# Altium schematic sheet IO_PWR_FMU3_REV_G.SchDoc: Pixhawk_mini_8L.sch
size A4; Date: 18/08/2014 1:53:31 PM; DrawnBy: Philip Rowse; SheetNumber: 10; SheetTotal: 10
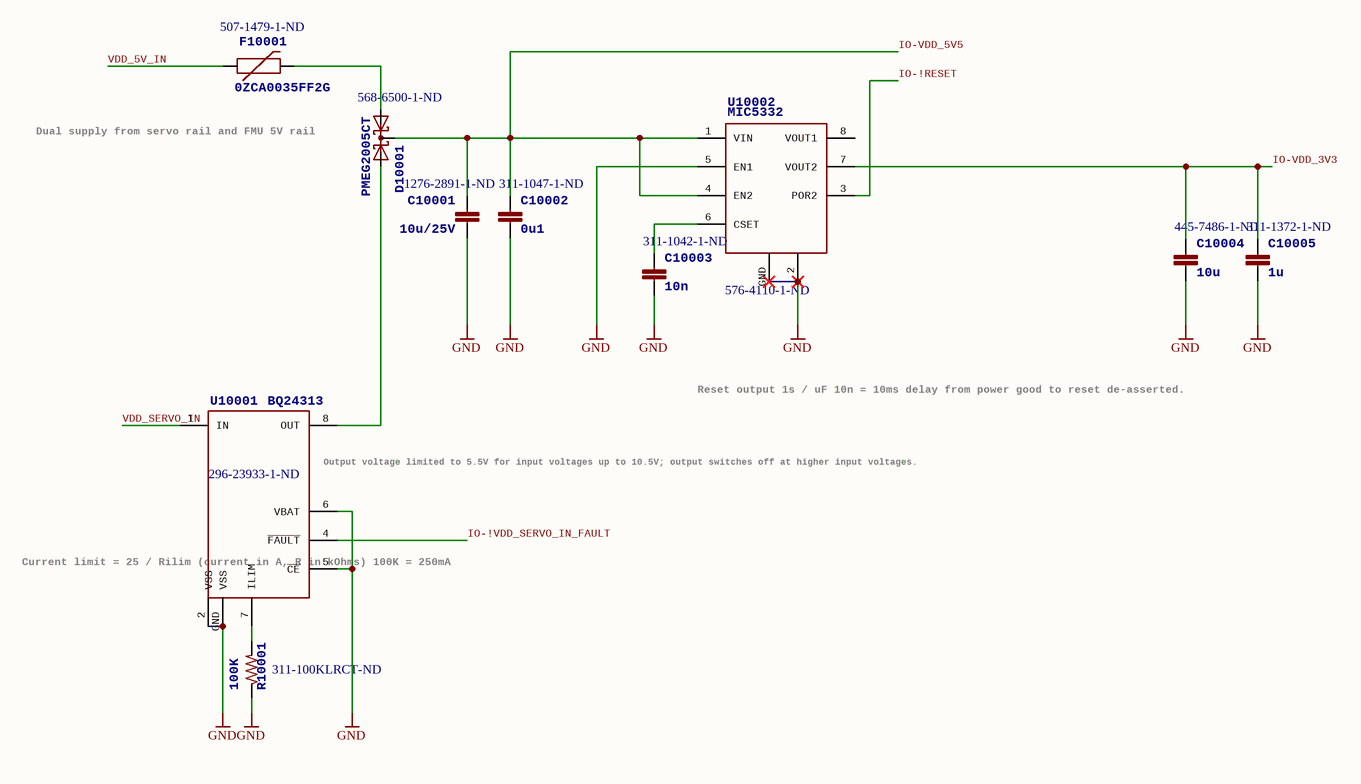
[diagram p0: IO_PWR_FMU3_REV_G.SchDoc]

## Parts
C10001  10u/25V  Supplier Part Number 1: 1276-2891-1-ND  [0805-CAP]
C10002  0u1  Supplier Part Number 1: 311-1047-1-ND  [0402-CAP]
C10003  10n  Supplier Part Number 1: 311-1042-1-ND  [0402-CAP]
C10004  10u  Supplier Part Number 1: 445-7486-1-ND  [0603-CAP]
C10005  1u  Supplier Part Number 1: 311-1372-1-ND  [0603-CAP]
D10001  PMEG2005CT  Supplier Part Number 1: 568-6500-1-ND  [SOT23-3]
F10001  0ZCA0035FF2G  Supplier Part Number 1: 507-1479-1-ND  [PTC-1206]
R10001  100K  Supplier Part Number 1: 311-100KLRCT-ND  [0402-RES]
U10001  BQ24313  Supplier Part Number 1: 296-23933-1-ND  [QFN8-DSG]
U10002  MIC5332  Supplier Part Number 1: 576-4110-1-ND  [MLF-8-EPAD]

## Nets
GND: C10001.P$2 C10002.P$2 C10003.P$2 C10004.P$2 C10005.P$2 R10001.P$1 U10001.2(VSS) U10001.5(~{CE}) U10001.6(VBAT) U10001.GND(VSS) U10002.2(GND) U10002.5(EN1) U10002.GND
IO-!RESET: U10002.3(POR2)
IO-!VDD_SERVO_IN_FAULT: U10001.4(~{FAULT})
IO-VDD_3V3: C10004.P$1 C10005.P$1 U10002.7(VOUT2)
IO-VDD_5V5: C10001.P$1 C10002.P$1 D10001.3(CC) U10002.1(VIN) U10002.4(EN2)
VDD_5V_IN: F10001.1
VDD_SERVO_IN: U10001.1(IN)
NetC10003_P$1: C10003.P$1 U10002.6(CSET)
NetD10001_1: D10001.1(A1) F10001.2
NetD10001_2: D10001.2(A2) U10001.8(OUT)
NetR10001_P$2: R10001.P$2 U10001.7(ILIM)

Not connected (* = marked no-connect by the designer): U10002 8(VOUT1)

## Notes on the sheet
- Dual supply from
  servo rail and FMU 5V rail
- Reset output 1s / uF
  10n = 10ms delay from power good
  to reset de-asserted.
- (near U10001) Output voltage limited to 5.5V for
  input voltages up to 10.5V; output
  switches off at higher input voltages.
- (near U10001) Current limit = 25 / Rilim
  (current in A, R in kOhms)
  100K = 250mA
- http://www.oshwa.org/
- http://creativecommons.org/licenses/by-sa/3.0/
- Title:
- Date:
- Time:
- Sheet:
- Approved:
- of:
- Drawn By:
- Checked By:
- 3DRobotics

## Library data of the parts
C10001 = CAP0805: CAP CER 10UF 25V 10% X5R 0805; PARTNO: CL21A106KAYNNNE; 3DR_PARTNO: ECM0714; Value: 10u/25; Supplier 1: Digi-Key
C10002 = CAP0402: CAP CER 0.1UF 16V Y5V 0402; PARTNO: CC0402ZRY5V7BB104; 3DR_PARTNO: ECM0700; Supplier 1: Digi-Key; Value: 0u1
C10003 = CAP0402: CAP CER 10000PF 16V 10% X7R 0402; PARTNO: CC0402KRX7R7BB103; 3DR_PARTNO: ECM0711; Supplier 1: Digi-Key; Value: 10n
C10004 = CAP0603: CAP CER 10UF 10V 10% X5R 0603; PARTNO: C1608X5R1A106K080AC; 3DR_PARTNO: ECM0712; Supplier 1: Digi-Key; Value: 10u
C10005 = CAP0603: CAP CER 1UF 16V Y5V 0603; PARTNO: CC0603ZRY5V7BB105; 3DR_PARTNO: ECM0705; Supplier 1: Digi-Key; Value: 1u
D10001 = PMEG2005CT: DIODE SCHOTTKY 20V 500MA TO236AB; 3DR_PARTNO: ECM0838; PARTNO: PMEG2005CT; Supplier 1: Digi-Key; Value: 20V
F10001 = PTCSMD: PTC RESTTBLE 0.35A 16V CHIP 1206; 3DR_PARTNO: ECM0802; PARTNO: 0ZCA0035FF2G; Supplier 1: Digi-Key; Value: 0.35A
R10001 = RESISTOR0402-RES: RES 100K OHM 1/16W 1% 0402 SMD; 3DR_PARTNO: ECM0818; PARTNO: RC0402FR-07100KL; Supplier 1: Digi-Key; Value: 100K
U10001 = BQ24313: IC LI+ CHARGER FRONT END 8-SON; 3DR_PARTNO: ECM0824; PARTNO: BQ24313DSGT; Supplier 1: Digi-Key
U10002 = MIC5332: IC REG LDO 3.3V 0.3A 8TMLF; 3DR_PARTNO: ECM0832; PARTNO: MIC5332-SSYMT TR; Supplier 1: Digi-Key; Value: 3.3V